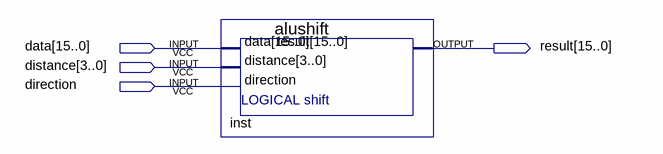
[diagram p0: schematic sheet]
// Quartus schematic lab4_3.bdf as structural Verilog: 1 symbols, 4 pins
module lab4_3 (
  input  [15:0] data,
  input  [3:0] distance,
  input  direction,
  output [15:0] result
);

  alushift inst (.data(data), .distance(distance), .direction(direction), .result(result));
endmodule
